# EAGLE design quad_copter (EAGLE 6.5.0)
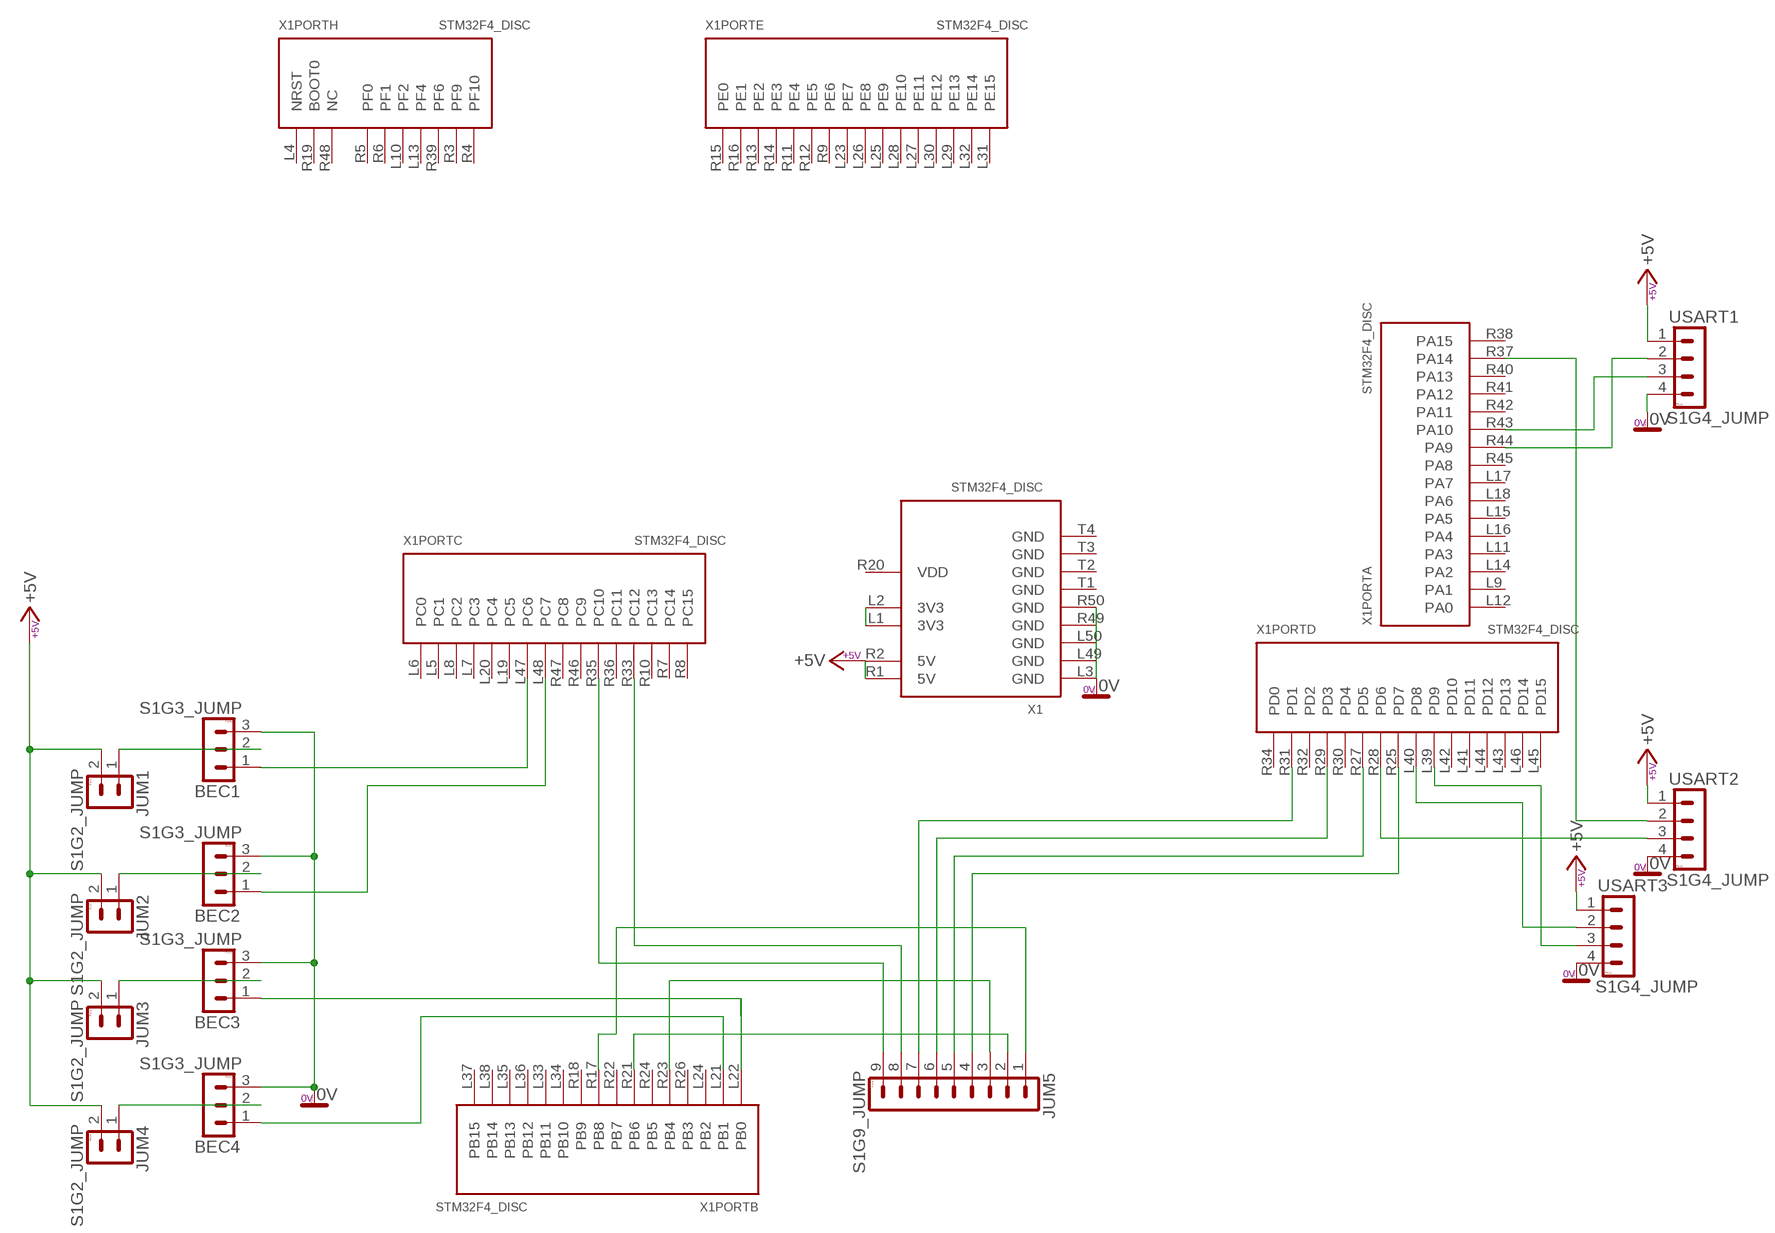
[diagram p0: schematic, sheet 1]

## Parts
BEC1  S1G3_JUMP  [S1G3_JUM]
BEC2  S1G3_JUMP  [S1G3_JUM]
BEC3  S1G3_JUMP  [S1G3_JUM]
BEC4  S1G3_JUMP  [S1G3_JUM]
JUM1  S1G2_JUMP  [S1G2_JUM]
JUM2  S1G2_JUMP  [S1G2_JUM]
JUM3  S1G2_JUMP  [S1G2_JUM]
JUM4  S1G2_JUMP  [S1G2_JUM]
JUM5  S1G9_JUMP  [S1G9_JUM]
USART1  S1G4_JUMP  [S1G4_JUM]
USART2  S1G4_JUMP  [S1G4_JUM]
USART3  S1G4_JUMP  [S1G4_JUM]
X1  STM32F4_DISC  [STM32F4_DISC]

## Nets
0V: BEC1.3 BEC2.3 BEC3.3 BEC4.3 USART1.4 USART2.4 USART3.4 X1.L3(GND) X1.L49(GND) X1.L50(GND) X1.R49(GND) X1.R50(GND)
+5V: JUM1.2 JUM2.2 JUM3.2 JUM4.2 USART1.1 USART2.1 USART3.1 X1.R1(5V) X1.R2(5V)
N$1: USART3.3 X1.L39(PD9)
N$2: USART3.2 X1.L40(PD8)
N$3: USART1.2 X1.R44(PA9)
N$4: USART1.3 X1.R43(PA10)
N$5: USART2.2 X1.R37(PA14)
N$7: X1.L1(3V3) X1.L2(3V3)
N$9: BEC4.2 JUM4.1
N$10: BEC3.2 JUM3.1
N$11: BEC2.2 JUM2.1
N$12: BEC1.2 JUM1.1
N$13: USART2.3 X1.R28(PD6)
N$14: BEC4.1 X1.L21(PB1)
N$15: BEC3.1 X1.L22(PB0)
N$16: BEC2.1 X1.L48(PC7)
N$17: BEC1.1 X1.L47(PC6)
N$20: JUM5.9 X1.R35(PC10)
N$21: JUM5.8 X1.R33(PC12)
N$22: JUM5.6 X1.R29(PD3)
N$23: JUM5.5 X1.R27(PD5)
N$24: JUM5.4 X1.R25(PD7)
N$25: JUM5.7 X1.R31(PD1)
N$27: JUM5.3 X1.R23(PB4)
N$28: JUM5.1 X1.R17(PB8)
N$29: JUM5.2 X1.R21(PB6)
Unconnected: X1.L4(NRST) X1.L5(PC1) X1.L6(PC0) X1.L7(PC3) X1.L8(PC2) X1.L9(PA1) X1.L10(PF2) X1.L11(PA3) X1.L12(PA0) X1.L13(PF4) X1.L14(PA2) X1.L15(PA5) X1.L16(PA4) X1.L17(PA7) X1.L18(PA6) X1.L19(PC5) X1.L20(PC4) X1.L23(PE7) X1.L24(PB2) X1.L25(PE9) X1.L26(PE8) X1.L27(PE11) X1.L28(PE10) X1.L29(PE13) X1.L30(PE12) X1.L31(PE15) X1.L32(PE14) X1.L33(PB11) X1.L34(PB10) X1.L35(PB13) X1.L36(PB12) X1.L37(PB15) X1.L38(PB14) X1.L41(PD11) X1.L42(PD10) X1.L43(PD13) X1.L44(PD12) X1.L45(PD15) X1.L46(PD14) X1.R3(PF9) X1.R4(PF10) X1.R5(PF0) X1.R6(PF1) X1.R7(PC14) X1.R8(PC15) X1.R9(PE6) X1.R10(PC13) X1.R11(PE4) X1.R12(PE5) X1.R13(PE2) X1.R14(PE3) X1.R15(PE0) X1.R16(PE1) X1.R18(PB9) X1.R19(BOOT0) X1.R22(PB7) X1.R24(PB5) X1.R26(PB3) X1.R30(PD4) X1.R32(PD2) X1.R34(PD0) X1.R36(PC11) X1.R38(PA15) X1.R39(PF6) X1.R40(PA13) X1.R41(PA12) X1.R42(PA11) X1.R45(PA8) X1.R46(PC9) X1.R47(PC8) X1.R48(NC)

## Power pins joined to a net without a drawn wire
GND: X1.T1(GND) X1.T2(GND) X1.T3(GND) X1.T4(GND)
VDD: X1.R20(VDD)

## Library data of the parts
BEC1-BEC4 = #PaJa_konektory:S1G3_JUMP: Radove konektory - koliky - 3x
JUM1-JUM4 = #PaJa_konektory:S1G2_JUMP: Radove konektory - koliky - 2x
JUM5 = #PaJa_konektory:S1G9_JUMP: Radove konektory - koliky - 9x
USART1-USART3 = #PaJa_konektory:S1G4_JUMP: Radove konektory - koliky - 4x
X1 = stm32f3_disc:STM32F4_DISC: STM32F4 Discovery Board

## Board
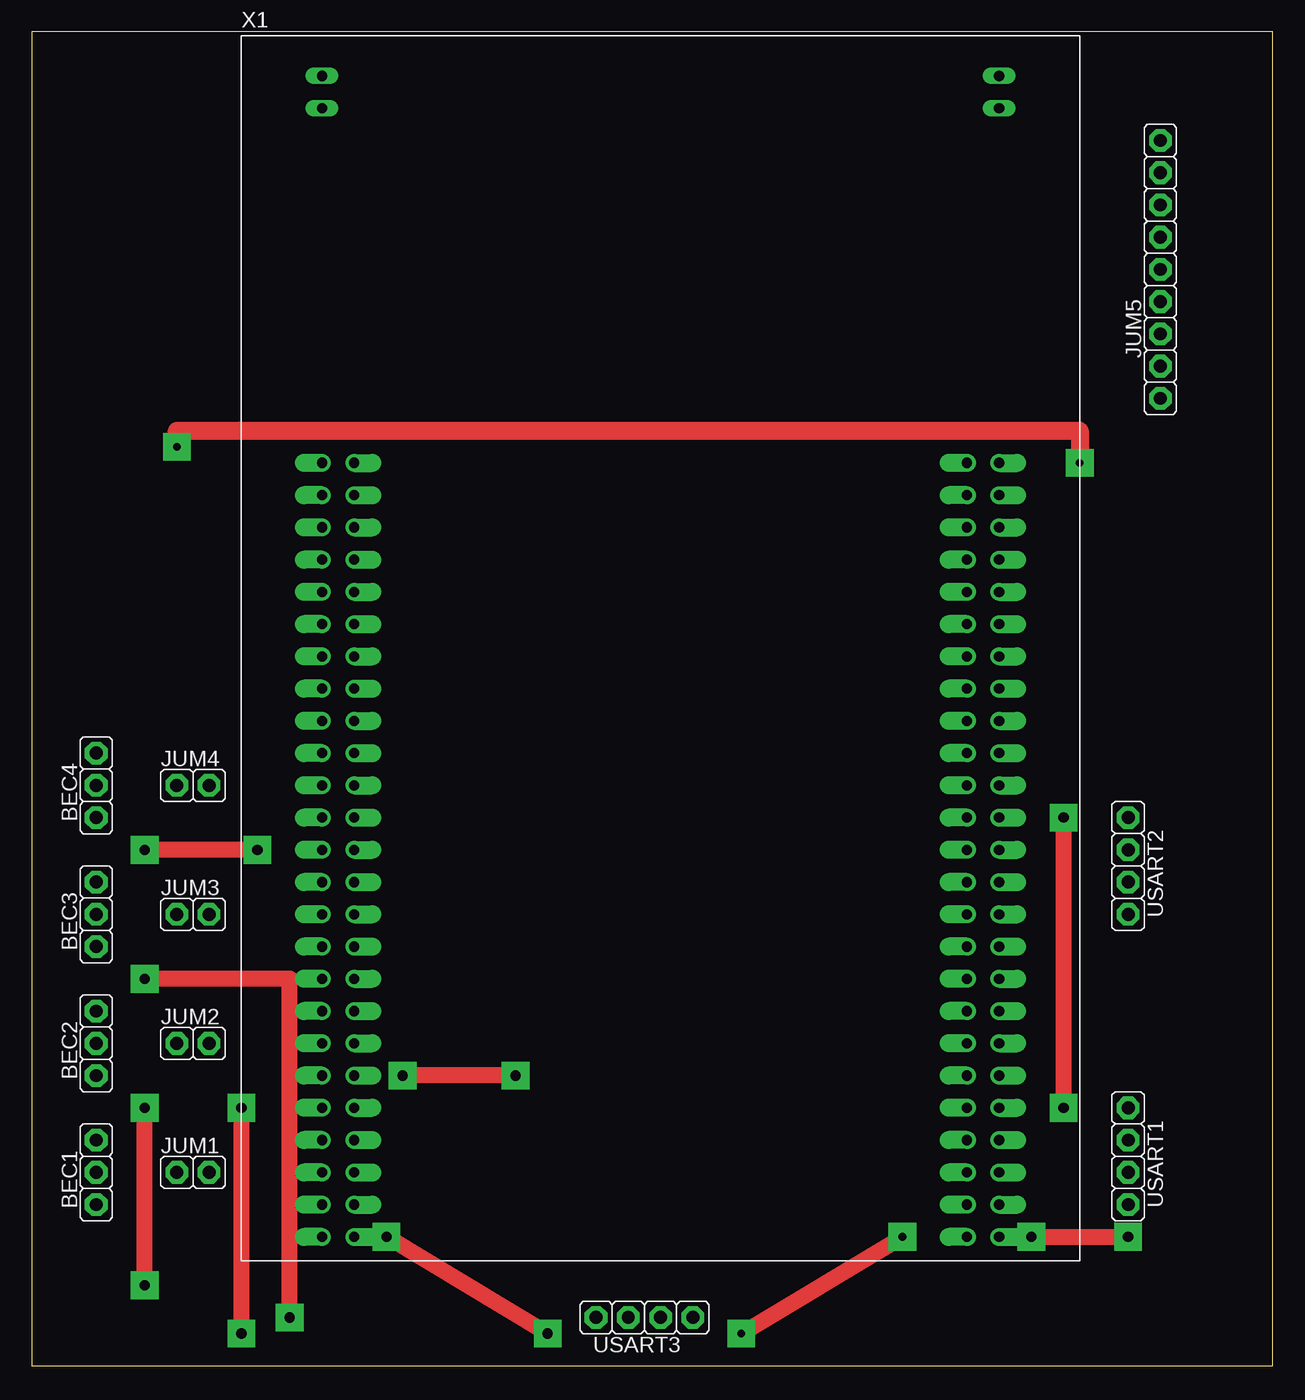
[diagram p1: board, top side]
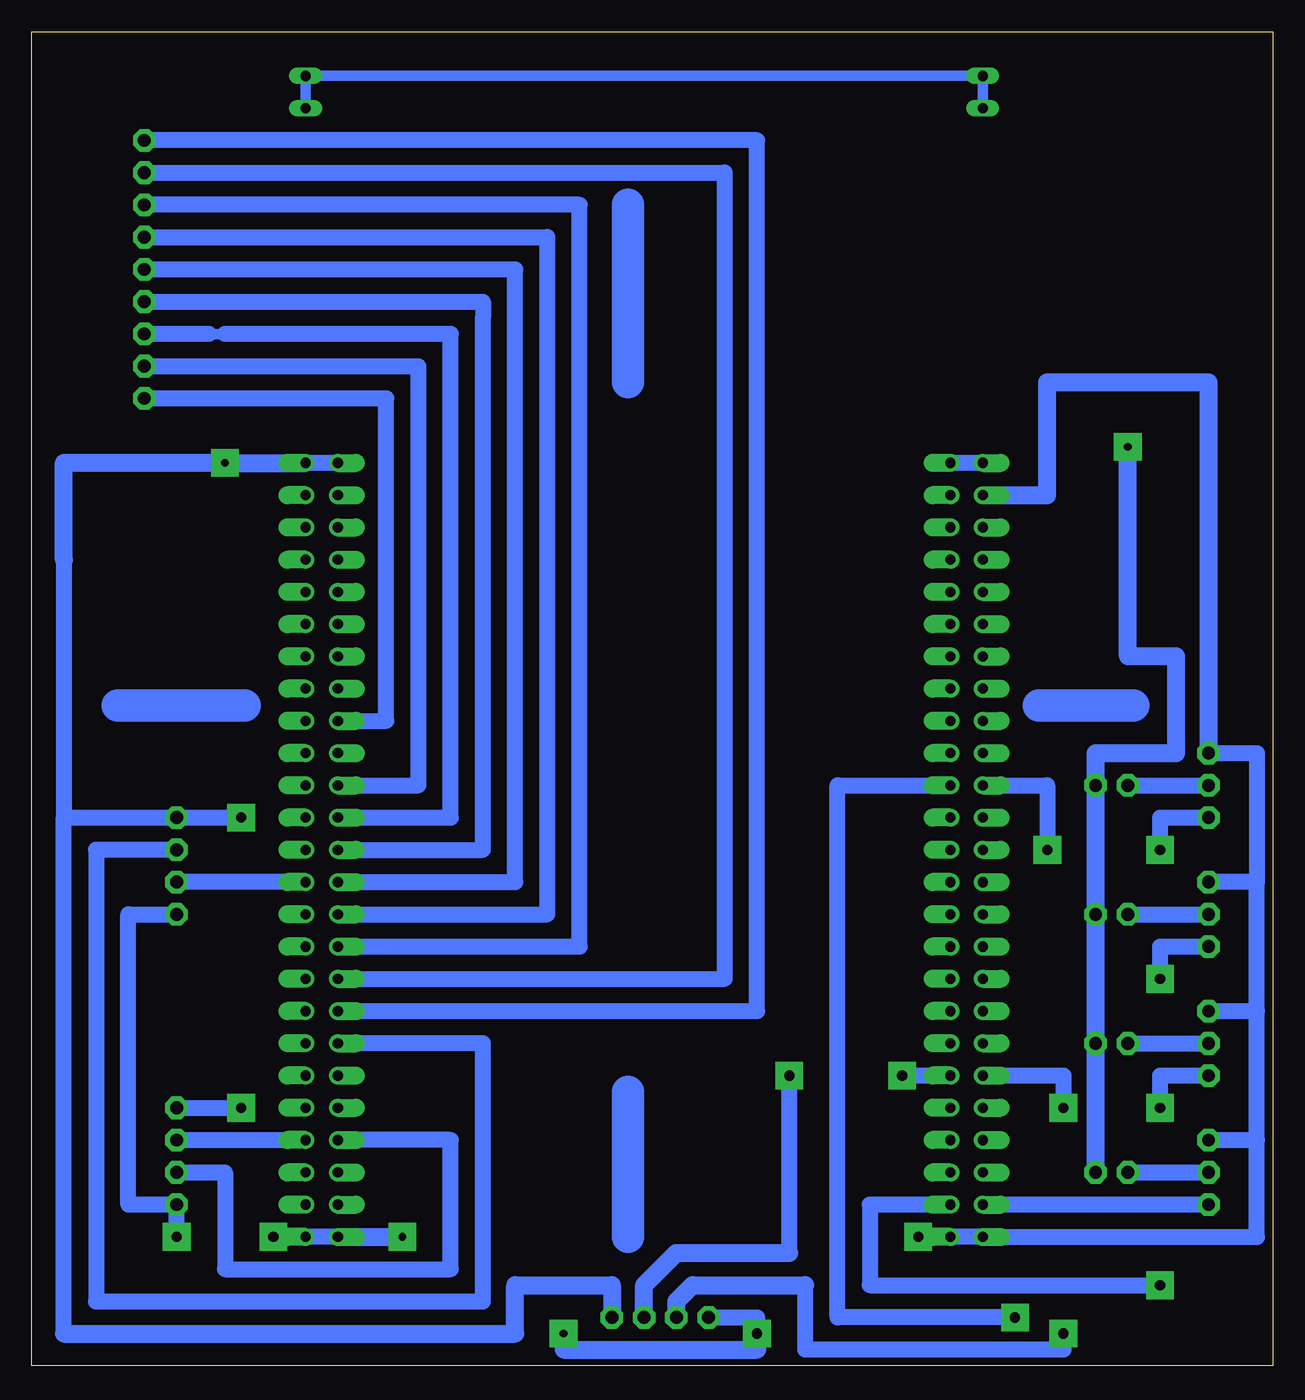
[diagram p2: board, bottom side, seen from below]

Size 97.77 x 105.08 mm. Coordinates in mm from the lower left corner, seen from the top.
Outline: 0,0 97.77,0 97.77,105.08 0,105.08 0,0
Copper layers (1*16): Top 0.035mm / dielectric 1.5mm / Bottom 0.035mm
Design rules "default": minimum track width 10mil, minimum drill 24mil, track to track 8mil, track to pad 8mil, pad to pad 8mil, via to via 8mil, smd to smd 8mil, copper to edge 40mil, drill to drill 8mil, minimum pad ring 10mil, minimum via ring 8mil, stop-mask expansion 4mil, vias tented up to drill 0mil, thermal gap 10mil

### Footprints (pad centres in the part's own frame; a part is rotated, then mirrored left to right if it is on the bottom)
S1G3_JUM = drill 1.016 pad 1.778 octagon: 1 -2.54,0; 2 0,0; 3 2.54,0
S1G2_JUM = drill 1.016 pad 1.778 octagon: 1 -1.27,0; 2 1.27,0
S1G9_JUM = drill 1.016 pad 1.778 octagon: 1 -10.16,0; 2 -7.62,0; 3 -5.08,0; 4 -2.54,0; 5 0,0; 6 2.54,0; 7 5.08,0; 8 7.62,0; 9 10.16,0
S1G4_JUM = drill 1.016 pad 1.778 octagon: 1 -3.81,0; 2 -1.27,0; 3 1.27,0; 4 3.81,0
STM32F4_DISC = drill 0.8 pad 1.422 offset: L1 -27.94,30.48; L2 -25.4,30.48; L3 -27.94,27.94; L4 -25.4,27.94; L5 -27.94,25.4; L6 -25.4,25.4; L7 -27.94,22.86; L8 -25.4,22.86; L9 -27.94,20.32; L10 -25.4,20.32; L11 -27.94,17.78; L12 -25.4,17.78; L13 -27.94,15.24; L14 -25.4,15.24; L15 -27.94,12.7; L16 -25.4,12.7; L17 -27.94,10.16; L18 -25.4,10.16; L19 -27.94,7.62; L20 -25.4,7.62; L21 -27.94,5.08; L22 -25.4,5.08; L23 -27.94,2.54; L24 -25.4,2.54; L25 -27.94,0; L26 -25.4,0; L27 -27.94,-2.54; L28 -25.4,-2.54; L29 -27.94,-5.08; L30 -25.4,-5.08; L31 -27.94,-7.62; L32 -25.4,-7.62; L33 -27.94,-10.16; L34 -25.4,-10.16; L35 -27.94,-12.7; L36 -25.4,-12.7; L37 -27.94,-15.24; L38 -25.4,-15.24; L39 -27.94,-17.78; L40 -25.4,-17.78; L41 -27.94,-20.32; L42 -25.4,-20.32; L43 -27.94,-22.86; L44 -25.4,-22.86; L45 -27.94,-25.4; L46 -25.4,-25.4; L47 -27.94,-27.94; L48 -25.4,-27.94; L49 -27.94,-30.48; L50 -25.4,-30.48; R1 22.86,30.48; R2 25.4,30.48; R3 22.86,27.94; R4 25.4,27.94; R5 22.86,25.4; R6 25.4,25.4; R7 22.86,22.86; R8 25.4,22.86; R9 22.86,20.32; R10 25.4,20.32; R11 22.86,17.78; R12 25.4,17.78; R13 22.86,15.24; R14 25.4,15.24; R15 22.86,12.7; R16 25.4,12.7; R17 22.86,10.16; R18 25.4,10.16; R19 22.86,7.62; R20 25.4,7.62; R21 22.86,5.08; R22 25.4,5.08; R23 22.86,2.54; R24 25.4,2.54; R25 22.86,0; R26 25.4,0; R27 22.86,-2.54; R28 25.4,-2.54; R29 22.86,-5.08; R30 25.4,-5.08; R31 22.86,-7.62; R32 25.4,-7.62; R33 22.86,-10.16; R34 25.4,-10.16; R35 22.86,-12.7; R36 25.4,-12.7; R37 22.86,-15.24; R38 25.4,-15.24; R39 22.86,-17.78; R40 25.4,-17.78; R41 22.86,-20.32; R42 25.4,-20.32; R43 22.86,-22.86; R44 25.4,-22.86; R45 22.86,-25.4; R46 25.4,-25.4; R47 22.86,-27.94; R48 25.4,-27.94; R49 22.86,-30.48; R50 25.4,-30.48 | drill 0.8 long: T1 -27.94,60.96; T2 -27.94,58.42; T3 25.4,60.96; T4 25.4,58.42

### Placement (x,y rotation side)
BEC1  5.08,15.24 90 top
BEC2  5.08,25.4 90 top
BEC3  5.08,35.56 90 top
BEC4  5.08,45.72 90 top
JUM1  12.7,15.24 0 top
JUM2  12.7,25.4 0 top
JUM3  12.7,35.56 0 top
JUM4  12.7,45.72 0 top
JUM5  88.9,86.36 90 top
USART1  86.36,16.51 270 top
USART2  86.36,39.37 270 top
USART3  48.26,3.81 180 top
X1  50.8,40.64 0 top

### Tracks (layer width: path | path; a pad name or v marks a point on that pad's centre or on a via)
0V  (via drill 0.6 pad 2.18, 0.8 pad 2.18)
  Top 1.27: v78.74,10.16 v86.36,10.16 | v40.64,2.54 v27.94,10.16 | v55.88,2.54 v68.58,10.16
  Bottom 1.27: BEC4.3 1.27,48.26 1.27,38.1 | 1.27,38.1 BEC3.3 | BEC1.3 1.27,17.78 | 1.27,17.78 1.27,27.94 | BEC2.3 1.27,27.94 | 1.27,27.94 1.27,38.1 | USART2.4 90.17,35.56 90.17,12.7 USART1.4 v86.36,10.16 | X1.R49 X1.R50 v78.74,10.16 | USART3.4 40.64,3.81 v40.64,2.54 | v27.94,10.16 X1.L50 X1.L49 1.27,10.16 1.27,17.78
  Bottom 1.422: X1.R49 v68.58,10.16 | v55.88,2.54 55.88,1.27 40.64,1.27 v40.64,2.54 | BEC4.3 5.08,77.47 17.78,77.47 17.78,68.58 X1.L3
+5V  (via drill 0.6 pad 2.18, 0.8 pad 2.18)
  Top 1.27: v81.28,20.32 v81.28,43.18
  Top 1.422: v11.43,72.39 11.43,73.66 82.55,73.66 v82.55,71.12
  Bottom 1.27: JUM1.2 JUM2.2 JUM3.2 JUM4.2 13.97,48.26 | X1.R1 X1.R2 | USART1.1 v81.28,20.32 | v81.28,43.18 USART2.1 95.25,43.18 | 95.25,2.54 95.25,43.18 | 95.25,63.5 95.25,43.18
  Bottom 1.422: 95.25,2.54 59.69,2.54 59.69,6.35 52.07,6.35 USART3.1 | 95.25,63.5 95.25,71.12 v82.55,71.12 X1.R2 | JUM1.2 13.97,48.26 7.62,48.26 7.62,55.88 11.43,55.88 v11.43,72.39
GND
  Bottom 0.813: X1.T2 X1.T1 X1.T3 X1.T4
N$1  (via drill 0.8 pad 2.18)
  Top 1.27: v16.51,20.32 v16.51,2.54
  Bottom 1.27: X1.L39 16.51,22.86 v16.51,20.32 | v16.51,2.54 16.51,1.27 36.83,1.27 36.83,6.35
  Bottom 1.422: USART3.3 46.99,5.08 45.72,6.35 36.83,6.35
N$2  (via drill 0.8 pad 2.18)
  Top 1.27: v38.1,22.86 v29.21,22.86
  Bottom 1.27: 38.1,8.89 v38.1,22.86 | v29.21,22.86 X1.L40
  Bottom 1.422: USART3.2 49.53,6.35 46.99,8.89 38.1,8.89
N$3
  Bottom 1.27: USART1.2 X1.R44
N$4
  Bottom 1.27: USART1.3 82.55,15.24 82.55,7.62 64.77,7.62 64.77,17.78 X1.R43
N$5
  Bottom 1.27: USART2.2 92.71,40.64 92.71,5.08 62.23,5.08 62.23,25.4 X1.R37
N$6
  Bottom 2.54: 50.8,91.44 50.8,77.47
N$7
  Bottom 1.27: X1.L1 X1.L2
N$8
  Bottom 2.54: 91,52 81,52
N$9
  Bottom 1.27: JUM4.1 BEC4.2
N$10
  Bottom 1.27: JUM3.1 BEC3.2
N$11
  Bottom 1.27: JUM2.1 BEC2.2
N$12
  Bottom 1.27: JUM1.1 BEC1.2
N$13
  Bottom 1.27: X1.R28 USART2.3
N$14  (via drill 0.8 pad 2.18)
  Top 1.27: v17.78,40.64 v8.89,40.64
  Bottom 1.27: X1.L21 17.78,45.72 v17.78,40.64 | v8.89,40.64 8.89,43.18 BEC4.1
N$15  (via drill 0.8 pad 2.18)
  Top 1.27: v20.32,3.81 20.32,30.48 v8.89,30.48
  Bottom 1.27: v20.32,3.81 34.29,3.81 34.29,45.72 X1.L22 | v8.89,30.48 8.89,33.02 BEC3.1
N$16  (via drill 0.8 pad 2.18)
  Top 1.27: v8.89,6.35 v8.89,20.32
  Bottom 1.27: X1.L48 31.75,12.7 31.75,6.35 v8.89,6.35 | v8.89,20.32 8.89,22.86 BEC2.1
N$17
  Bottom 1.27: BEC1.1 X1.L47
N$18
  Bottom 2.54: 11,52 18.46,52
N$19
  Bottom 2.54: 50.8,10.16 50.8,21.59
N$20
  Bottom 1.27: X1.R35 40.64,27.94 40.64,96.52 JUM5.9
N$21
  Bottom 1.27: X1.R33 43.18,30.48 43.18,93.98 JUM5.8
N$22
  Bottom 1.27: X1.R29 57.15,35.56 57.15,88.9 JUM5.6
N$23
  Bottom 1.27: X1.R27 59.69,38.1 59.69,86.36 JUM5.5
N$24
  Bottom 1.27: X1.R25 62.23,40.64 62.23,82.55 62.23,83.82 JUM5.4
N$25
  Bottom 1.27: X1.R31 54.61,33.02 54.61,91.44 JUM5.7
N$27
  Bottom 0.813: 82.55,81.28 83.82,81.28
  Bottom 1.27: X1.R23 64.77,43.18 64.77,81.28 82.55,81.28 | 83.82,81.28 JUM5.3
N$28
  Bottom 1.27: X1.R17 69.85,50.8 69.85,76.2 JUM5.1
N$29
  Bottom 1.27: X1.R21 67.31,45.72 67.31,78.74 JUM5.2